# Altium schematic sheet Transformer-Recitifer.SchDoc
size A4; SheetNumber: 2; SheetTotal: 6
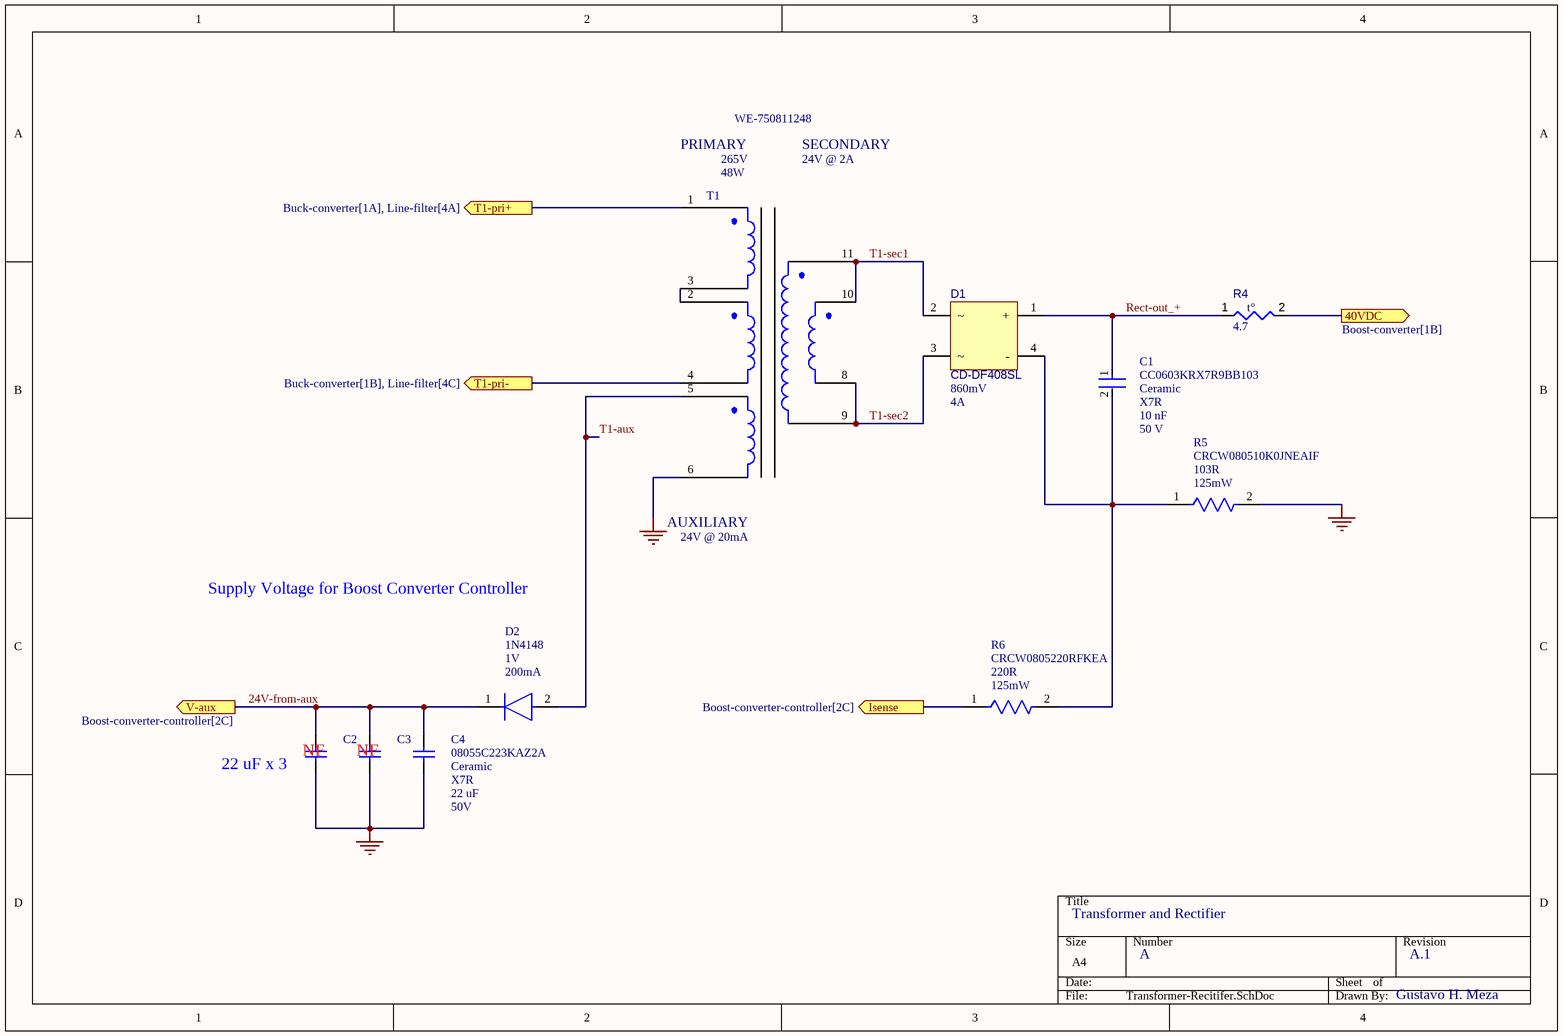
[diagram p0: Transformer-Recitifer.SchDoc]

## Parts
C1  CC0603KRX7R9BB103  Temperature Characteristic: X7R  Voltage Rating: 50 V  Material: Ceramic  Capacitance: 10 nF  [FP-CC0603-DA-MFG]
C2  08055C223KAZ2A  [CAPC2013X94X50ML20T25]  (value not drawn)
C3  08055C223KAZ2A  [CAPC2013X94X50ML20T25]  (value not drawn)
C4  08055C223KAZ2A  Capacitance: 22 uF  Voltage rating: 50V  Dieleectric: X7R  Material: Ceramic  [CAPC2013X94X50ML20T25]
D1  CD-DF408SL  Forward Voltage: 860mV  Forward Current: 4A  [CD-DF408SL-Footprint-1]
D2  1N4148  Forward Voltage: 1V  Output Current: 200mA  [FP-017AG-MFG]
R4  value 4.7  [B57236S0479M000-Footprint-1]  (hidden comment: B57236S0479M000)
R5  CRCW080510K0JNEAIF  Max Power Dissipation: 125mW  Resistance: 103R  [FP-CRCW0805-e3-MFG]
R6  CRCW0805220RFKEA  Max Power Dissipation: 125mW  Resistance: 220R  [FP-CRCW0805-e3-MFG]
T1  WE-750811248  Power: 48W  Voltage Rating: 265V  Auxiliary winding voltage: 24V @ 20mA  Secondary winding voltage: 24V @ 2A  [WE-750811248-Footprint-1]

## Ports
40VDC (out, see Boost-converter[1B]), Isense (out, see Boost-converter-controller[2C]), T1-pri+ (out, see Buck-converter[1A], Line-filter[4A]), T1-pri- (out, see Buck-converter[1B], Line-filter[4C]), V-aux (out, see Boost-converter-controller[2C])

## Nets
GND: C2.1 C3.1 C4.1 R5.2 T1.6
24V-from-aux: C2.2 C3.2 C4.2 D2.1(C) ; port V-aux
40VDC: R4.2 ; port 40VDC
Isense: R6.1 ; port Isense
Rect-out_+: C1.1 D1.1(+) R4.1
T1-aux: D2.2(A) T1.5
T1-pri+: T1.1 ; port T1-pri+
T1-pri-: T1.4 ; port T1-pri-
T1-sec1: D1.2 T1.10 T1.11
T1-sec2: D1.3 T1.8 T1.9
NetC1_2: C1.2 D1.4(-) R5.1 R6.2
NetT1_2: T1.2 T1.3

## Notes on the sheet
- PRIMARY
- SECONDARY
- (near T1) AUXILIARY
- Supply Voltage for Boost Converter Controller
- (near C2) 22 uF x 3
- (near C2) NF
- (near C3) NF
- Transformer and Rectifier
- A
- A.1
- Gustavo H. Meza
- (in symbol CMP-009-00189-1) t°

## Library data of the parts
C1 = CMP-2100-03600-2: CAP CER 10000PF 50V X7R 0603; Manufacturer: YAGEO; Tolerance: 0.1; Temperature Coefficient: 15%; Value: 10 nF; Mouser Description: Multilayer Ceramic Capacitor, CC Series, 0.01 - F, - 10%, X7R, 50 V, 0603 [1608 Metric]; Digikey Description: CAP CER 10000PF 50V X7R 0603; Height: 0.9mm; Category: Cap; Footprint Url: http://www.yageo.com/exep/pages/download/literatures/UPY-C_GEN_24.pdf; Lead Free: Yes; Manufacturer Part Number: CC0603KRX7R9BB103; Temperature: -55°C to +125°C; Device Class L3: Ceramic Capacitors; ComponentLink2Description: Datasheet; Voltage: 50 V; Package: CC0603-DA; Octopart: https://octopart.com/cc0603krx7r9bb103-yageo-192938; Automotive: No; Temperature Range High: +125°C; Temperature Range Low: -55°C; RoHS: TRUE; Device Class L1: Passive Components; ComponentLink2URL: http://www.yageo.com/documents/recent/UPY-GPHC_X7R_6.3V-to-50V_18.pdf; Device Class L2: Capacitors
C2-C4 = CMP-2007-04398-1: Manufacturer: AVX Interconnect / Elco; Part Number: 08055C223KAZ2A
D1 = CMP-004-00034-1: Bridge Rectifier Diode, 1 Phase, 4A, 800V V(RRM), Silicon; Max Surge Current: 150A; Reach SVHC Compliant: No; Min Operating Temperature: -55°C; Max Operating Temperature: 175°C; RoHS Compliant: Yes; Mounting Technology: Flat; JESD-609 Code: e3; Diode Type: RECTIFIER
D2 = CMP-07163-000046-1: DIODE GEN PURP 100V 200MA DO35; Max Power Dissipation: 500mW; Max Reverse Current: 5uA; Forward Current: 300mA; Current: 4A; Reverse Recovery Time: 4ns; Element Configuration: Single; Outside Diameter: 1.85mm; Capacitance: 4pF; Polarity: Standard; Max Forward Surge Current (Ifsm): 1A; Reverse Voltage: 100V; Average Rectified Current: 200mA; Diameter: 1.91mm; Max Repetitive Reverse Voltage (Vrrm): 100V; Current Rating: 200mA; Case/Package: DO-35; Lead Free: Lead Free; Number of Pins: 2; Recovery Time: 4ns; Packaging: Bulk; Contact Plating: Tin; Voltage: 100V; Mount: Through Hole; Max Surge Current: 4A; Package Quantity: 2000; Width: 1.91mm; Max Reverse Voltage (DC): 100V; Length: 4.56mm; Radiation Hardening: No; Power Dissipation: 500mW; Voltage Rating (DC): 100V; Peak Non-Repetitive Surge Current: 4A; REACH SVHC: No SVHC; Height: 4.56mm; Max Operating Temperature: 175°C; Series: -; Weight: 0.01lb; Min Operating Temperature: -65°C
R4 = CMP-009-00189-1: NTC Thermistor, 4.7ohm, Through Hole Mount; Tolerance: 20%; Power: 2.1W; Mounting Technology: Through Hole; Max Operating Temperature: 170°C; Min Operating Temperature: -55°C; JESD-609 Code: e3; Manufacturer Series: B57236S0479M000; RoHS Compliant: Yes; Pins: 2
R5 = CMP-00030-42634559-1: CRCW080510K0JNEAIF Res Thick Film 0805 10K Ohm 5% 0.125W(1/8W) ±200ppm/°C Pad SMD Automotive T/R; Manufacturer Package Identifier: CRCW0805-e3; Voltage Rating: 150V; Depth: 1.25mm; Case Code (Metric): 2012; Case/Package: 0805; Military Standard: Not; NexarPartId: 42634559; Case Code (Imperial): 0805; Termination: Solder; Width: 1.2446mm; REACH SVHC: Unknown; Min Operating Temperature: -55°C; Length: 2mm; Packaging: Tape & Reel (TR); Lead Free: Lead Free; Number of Pins: 2; Power Rating: 125mW; Composition: Thick Film; RoHS: Compliant; Temperature Coefficient: 200ppm/°C; Features: Automotive AEC-Q200; Voltage Rating (DC): 150V; Height: 508µm; Tolerance: 5%; Schedule B: 8533210045, 8533210045; Max Operating Temperature: 155°C; Number of Terminations: 2
R6 = CMP-2001-03682-2: RES Thick Film, 220Ω, 1%, 0.125W, 100ppm/°C, 0805; Voltage Rating: 150V; Packaging: Tape and Reel; Termination: SMD/SMT; Height: 0.45mm; Package Quantity: 10; Width: 0.049inch; Min Operating Temperature: -55°C; Lead Free: Lead Free; Military Standard: Not; Mount: Surface Mount; Max Operating Temperature: 155°C; Voltage Rating (DC): 150V; Composition: Thick Film; Case/Package: 0805; Length: 2mm; Weight: 0.000194oz; Case Code (Metric): 2012; Number of Terminations: 2; Case Code (Imperial): 0805; Radiation Hardening: No; Tolerance: 1%; Features: Automotive AEC-Q200; Power Rating: 125mW; Depth: 1.25mm; Contact Plating: Tin; Temperature Coefficient: 100ppm/°C
T1 = CMP-012-00000-1: Power Transformers MID-L3798/99 Offline Isol 3.6uH +-10%; Inductance: 300uH; Turns Ratio: 0.167372; Min Operating Temperature: -40°C; Mounting Technology: THT; Max Operating Temperature: 125°C; Pins: 10; RoHS Compliant: Yes